# EAGLE design sensor_board (EAGLE 9.0.0)
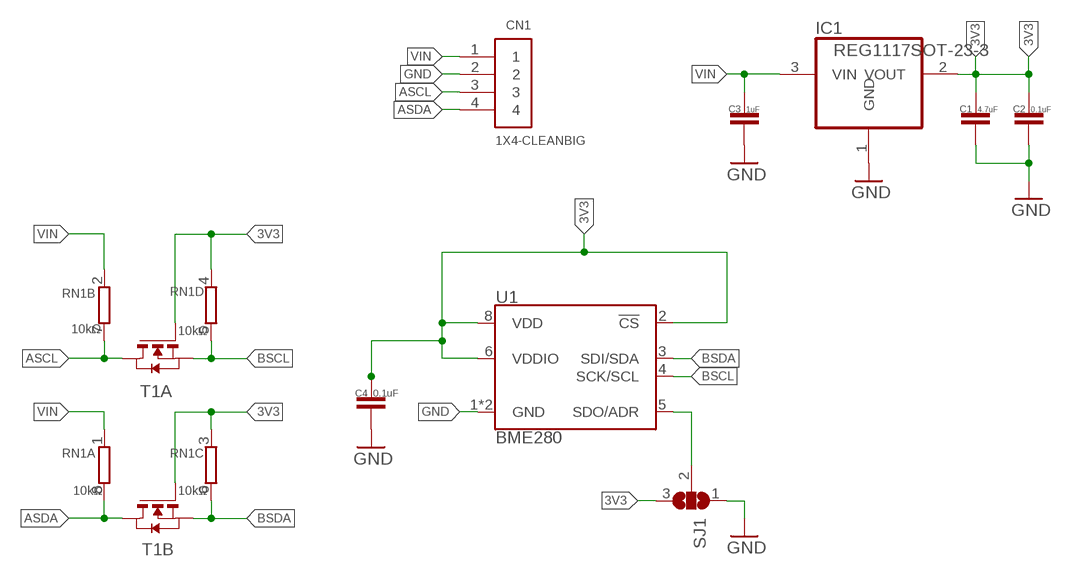
[diagram p0: schematic, sheet 1]

## Parts
C1  4.7uF  C-EUC0603  [C0603]
C2  0.1uF  C-EUC0603  [C0603]
C3  1uF  C-EUC0603  [C0603]
C4  0.1uF  C-EUC0603  [C0603]
CN1  1X4-CLEANBIG  [1X04-CLEANBIG]
IC1  REG1117SOT-23-3  [SOT23-3]
RN1  10kΩ  4R-NEXB38V  [EXB38V]
SJ1  SJ2W  [SJ_2]
T1  ZXMD63N03XSOT-363  [SOT-363]
U1  BME280  [LGA-8-2.5X2.5]

## Nets
3V3: C1.1 C2.1 C4.1 IC1.2(VOUT) RN1.3 RN1.4 SJ1.3 T1.2(A:G) T1.5(B:G) U1.2(!CS) U1.6(VDDIO) U1.8(VDD)
ASCL: CN1.3 RN1.7 T1.6(A:D)
ASDA: CN1.4 RN1.8 T1.3(B:D)
BSCL: RN1.5 T1.1(A:S) U1.4(SCK/SCL)
BSDA: RN1.6 T1.4(B:S) U1.3(SDI/SDA)
GND: C1.2 C2.2 C3.2 C4.2 CN1.2 IC1.1(GND) SJ1.1 U1.1(GND) U1.7(GND)
N$1: SJ1.2 U1.5(SDO/ADR)
VIN: C3.1 CN1.1 IC1.3(VIN) RN1.1 RN1.2

## Library data of the parts
C1-C4 = rcl:C-EU: CAPACITOR, European symbol; SPICEPREFIX: C
CN1 = adafruit:1X4: 4-pin connector
IC1 = sensor_board:REG1117: 800mA and 1A Low Dropout (LDO) Positive Regulator 1.8V, 2.5V, 2.85V, 3.3V, 5V, and Adj
RN1 = resistor-dil:4R-N: Array Chip Resistor Source: RS Component / Phycomp; OC_FARNELL: unknown; OC_NEWARK: unknown
SJ1 = jumper:SJ2W: SMD solder JUMPER
T1 = sensor_board:ZXMD63N03X: DUAL 30V N-CHANNEL ENHANCEMENT MODE MOSFET Source: Data sheet <http://www.diodes.com/datasheets/ZXMD63N03X.pdf>
U1 = SparkFun-Sensors:BME280: Bosch BME280 – Combined Humidity and Pressure Sensor The BME280 is as combined digital humidity, pressure and temperature sensor based on proven sensing principles. The sensor module is housed in an extremely compact metal-lid LGA package with a footprint of only 2.5×2.5mm² with a height of 0.93mm. Its small dimensions and its low power consumption allow the implementation in battery driven devices such as handsets, GPS modules or watches. Datasheet <https://cdn.sparkfun.com/assets/learn_tutorials/4/1/9/BST-BME280_DS001-10.pdf> SparkFun Products SparkFun Atmospheric Sensor Breakout - BME280 <https://www.sparkfun.com/products/13676> (SEN-13676); PROD_ID: IC-13090

## Board
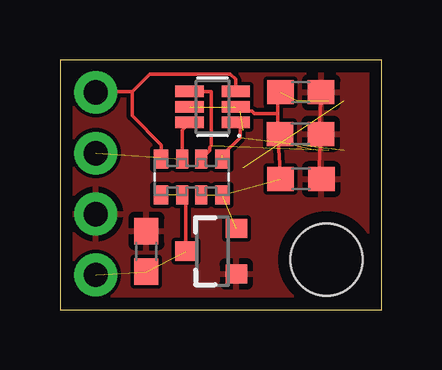
[diagram p1: board, top side]
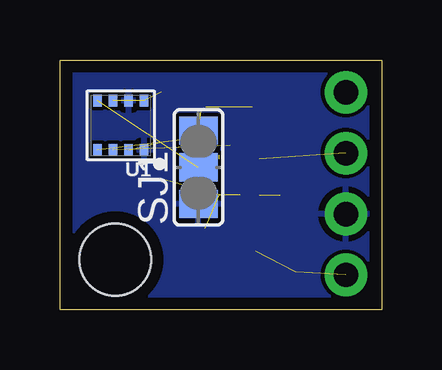
[diagram p2: board, bottom side, seen from below]

Size 13.4 x 10.43 mm. Coordinates in mm from the lower left corner, seen from the top.
Outline: 0,0 13.4,0 13.4,10.43 0,10.43 0,0
Copper layers (1*16): Top 0.035mm / dielectric 1.5mm / Bottom 0.035mm
Design rules "default *": minimum track width 6mil, minimum drill 0.35mm, track to track 6mil, track to pad 6mil, pad to pad 6mil, via to via 6mil, smd to smd 6mil, copper to edge 20mil, drill to drill 6mil, minimum pad ring 10mil, minimum via ring 8mil, stop-mask expansion 4mil, vias tented up to drill 0mil, thermal gap 10mil
Holes 3 mm at 11.1,2.1

### Footprints (pad centres in the part's own frame; a part is rotated, then mirrored left to right if it is on the bottom)
C0603 = smd 1.1 x 1: 1 -0.85,0; 2 0.85,0
1X04-CLEANBIG = drill 1.016 pad 1.778: 1 -3.81,0; 2 -1.27,0; 3 1.27,0; 4 3.81,0
SOT23-3 = smd 0.8 x 0.9: 1 -0.95,-1; 2 0.95,-1; 3 0,1.1
EXB38V = smd 0.6 x 0.8: 1 -1.275,-0.75; 4 1.275,-0.75; 5 1.275,0.75; 8 -1.275,0.75 | smd 0.5 x 0.8: 2 -0.4,-0.75; 3 0.4,-0.75; 6 0.4,0.75; 7 -0.4,0.75
SJ_2 = smd 1.168 x 1.6: 1 -1.524,0; 2 0,0; 3 1.524,0
SOT-363 = smd 1.186 x 0.472: 1 -0.962,0.65; 2 -0.962,0; 3 -0.962,-0.65; 4 0.962,-0.65; 5 0.962,0; 6 0.962,0.65
LGA-8-2.5X2.5 = smd 0.35 x 0.5: 1 -0.975,1.025; 2 -0.325,1.025; 3 0.325,1.025; 4 0.975,1.025; 5 0.975,-1.025; 6 0.325,-1.025; 7 -0.325,-1.025; 8 -0.975,-1.025

### Placement (x,y rotation side)
C1  10.03,9.08 0 top
C2  10.02,7.34 0 top
C3  3.6,2.44 90 top
C4  10.04,5.46 0 top
CN1  1.49,5.27 90 top
IC1  6.35,2.45 90 top
RN1  5.49,5.55 0 top
SJ1  7.63,5.95 90 bottom
T1  6.36,8.47 180 top
U1  10.87,7.7 180 bottom

### Tracks (layer width: path | path; a pad name or v marks a point on that pad's centre or on a via)
3V3  (8 unrouted)
  Top 0.152: C4.1 9.09,7.02 C2.1 9.07,7.9 9.07,8.2 | 9.07,8.2 9.07,8.77 C1.1 | 9.07,8.2 8.09,8.2 8.01,8.28 7.51,8.28 T1.2
ASCL  (1 unrouted)
  Top 0.152: T1.6 5.09,7.51 RN1.7
ASDA
  Top 0.152: CN1.4 1.51,9.1 3,9.1 | 3,9.1 3.75,9.85 7.1,9.85 7.32,9.62 T1.3 | RN1.8 4.21,6.88 3,8.1 3,9.1
BSCL  (2 unrouted)
  Top 0.152: 6.76,6.46 7.5,7.2 7.5,7.64 T1.1
BSDA  (1 unrouted)
  Top 0.152: T1.4 5.42,9.1 6.3,9.1 6.3,6.86 6.24,6.79 6.24,6.65 RN1.6
GND
  Top 0.152: C1.2 10.78,7.05 C2.2 10.77,5.18 C4.2
  pour Top: 0.1,10.3 0.1,0.2 0.2,0.1 13.3,0.1 13.3,10.3
  pour Bottom: 0.1,10.3 0.1,0.1 13.3,0.1 13.3,10.3
N$1  (1 unrouted)
VIN  (3 unrouted)
  Top 0.152: IC1.3 5.25,4.64 RN1.2